# Altium schematic sheet 8_Secret.SchDoc
size A
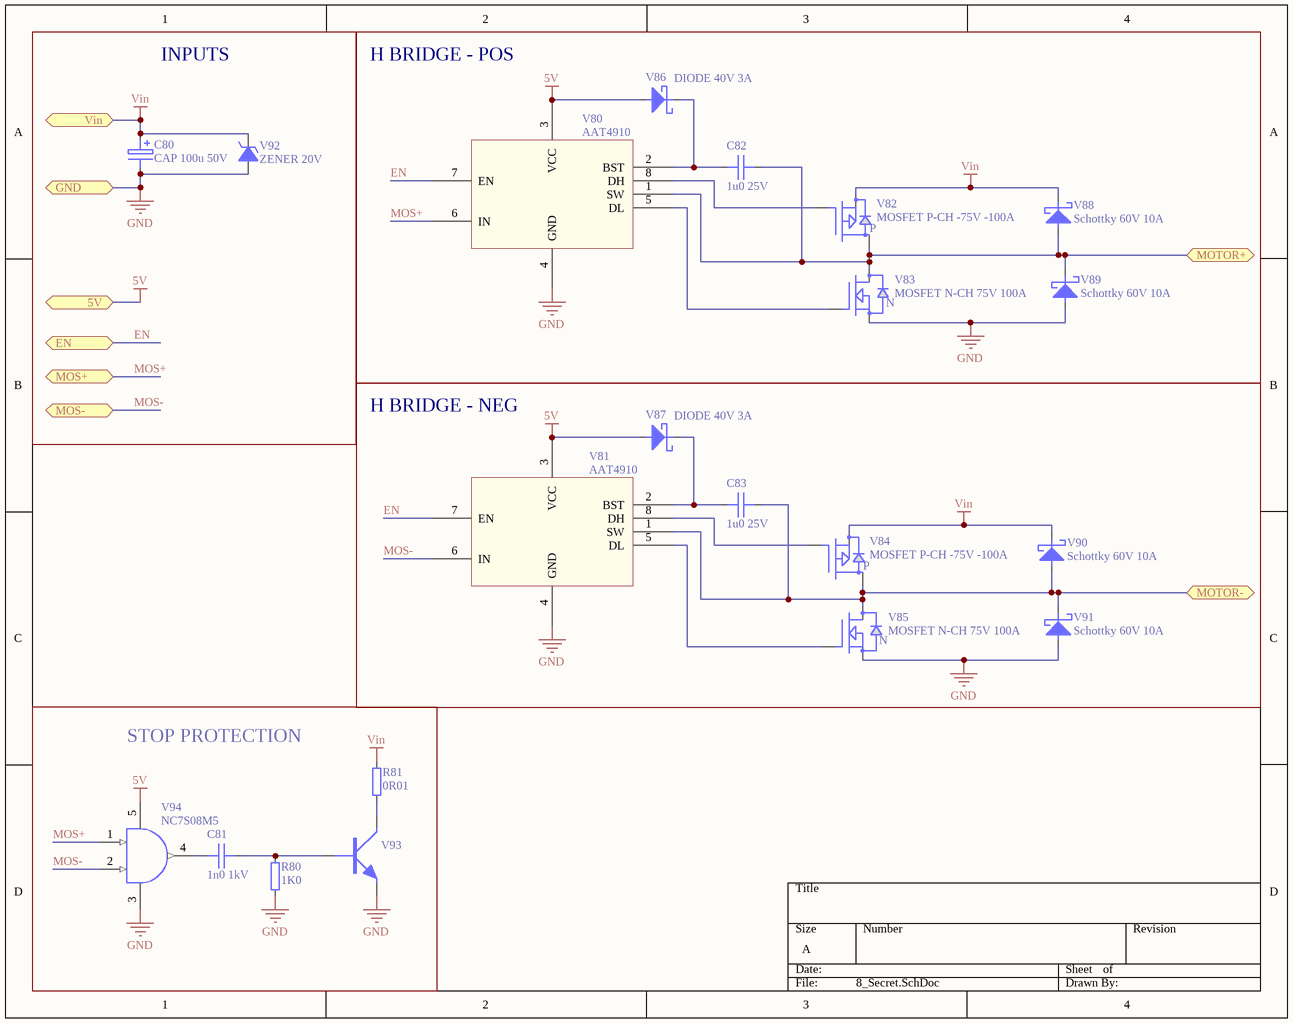
[diagram p0: 8_Secret.SchDoc]

## Parts
C80  CAP 100u 50V  [CAP-ELECT-SMD-F]
C81  1n0 1kV  [1206]
C82  1u0 25V  [1206]
C83  1u0 25V  [1206]
R80  1K0  [1206]
R81  0R01  [AXIAL-25.4-1.1-12.7]
V80  AAT4910  [TFSOJ-8]
V81  AAT4910  [TFSOJ-8]
V82  MOSFET P-CH -75V -100A  [TO263_2_D2PAK]
V83  MOSFET N-CH 75V 100A  [TO263_2_D2PAK]
V84  MOSFET P-CH -75V -100A  [TO263_2_D2PAK]
V85  MOSFET N-CH 75V 100A  [TO263_2_D2PAK]
V86  DIODE 40V 3A  [DO214AB-DIODE]
V87  DIODE 40V 3A  [DO214AB-DIODE]
V88  Schottky 60V 10A  [DO-214AB-DIODE]
V89  Schottky 60V 10A  [DO-214AB-DIODE]
V90  Schottky 60V 10A  [DO-214AB-DIODE]
V91  Schottky 60V 10A  [DO-214AB-DIODE]
V92  ZENER 20V  [DO-214AA-DIODE]
V93  BC846B  [SOT23]  (value not drawn)
V94  NC7S08M5  [SOT23-5]

## Blocks framed on the sheet
INPUTS: C80 V92
H BRIDGE - POS: C82 V80 V82 V83 V86 V88 V89
H BRIDGE - NEG: C83 V81 V84 V85 V87 V90 V91
STOP PROTECTION: C81 R80 R81 V93 V94

## Ports
5V, EN, GND, MOS+, MOS-, MOTOR+, MOTOR-, Vin

## Nets
5V: V80.3(VCC) V81.3(VCC) V86.a V87.a V94.5(VCC) ; port 5V
GND: C80.- R80.1 V80.4(GND) V81.4(GND) V83.y(s) V85.y(s) V89.a V91.a V92.a V93.y(Emitter) V94.3(GND) ; port GND
Vin: C80.+ R81.2 V82.y(s) V84.y(s) V88.k V90.k V92.k ; port Vin
EN: V80.7(EN) V81.7(EN) ; port EN
MOS+: V80.6(IN) V94.1 ; port MOS+
MOS-: V81.6(IN) V94.2 ; port MOS-
MOTOR+: C82.2 V80.1(SW) V82.x(d(tab)) V83.x(d) V88.a V89.k ; port MOTOR+
MOTOR-: C83.2 V81.1(SW) V84.x(d(tab)) V85.x(d) V90.a V91.k ; port MOTOR-
NetC81_1: C81.1 V94.4
NetC81_2: C81.2 R80.2 V93.z(Base)
NetC82_1: C82.1 V80.2(BST) V86.k
NetC83_1: C83.1 V81.2(BST) V87.k
NetR81_1: R81.1 V93.x(Collector)
NetV80_5: V80.5(DL) V83.z(gate)
NetV80_8: V80.8(DH) V82.z(gate)
NetV81_5: V81.5(DL) V85.z(gate)
NetV81_8: V81.8(DH) V84.z(gate)

## Notes on the sheet
- (in symbol 9926) P
- (in symbol 9927) N

## Library data of the parts
C80 = 5174: Capacitor Polarised; Part Field 1: CAP ELEC 100u +/-20% 50V VS SMD-F; Manufacturer: Panasonic-ECG; PartNumber: EEE1HA101UP; IPN: 5174; EndOfLife: Active EOL:Jul 2022; AltIPN1: 7605; AltDesc1: CAP ELEC 100u +/-20% 50V SMD-F; AltMFG1: Nichicon; AltPN1: UWT1H101MNL1GS; AltEOL1: Active EOL:Sep 2023; Characteristics: -40..+85C Reel=500; Lead_Process_Compatible: Yes; SubmittedBy: FXT; DeviceRank: 2; Part Field 2: Panasonic-ECG EEE1HA101UP; ComponentLink1Description: Panasonic-ECG_EEE1HA101UP_Panasonic_VS.pdf; ComponentLink2Description: Panasonic-ECG_EEE1HA101UP_Panasonic-SMD-Capacitor-ABA0000PE220.pdf; ComponentLink1URL: http://ecad.vsl.com.au/apps/BomGen/Data/rel/datasheets/Panasonic-ECG/Panasonic-ECG_EEE1HA101UP_Panasonic_VS.pdf; ComponentLink2URL: http://ecad.vsl.com.au/apps/BomGen/Data/rel/rohs_compliance/new_certificates/Panasonic-ECG_EEE1HA101UP_Panasonic-SMD-Capacitor-ABA0000PE220.pdf; Altium_Comment_Old: CAP ELEC 100u +/-20% 50V VS SMD-F; Altium_Comment: CAP 100u 50V; Symbol: CAP-POL; LastChanged: 23/05/14 15:25:48; AltROHS1: Nichicon_UWT1H101MNL1GS_RoHS.pdf; Supplier1: Tenrod; Supplier1_PartNumber: EEE1HA101UP; Supplier2: Digikey; Supplier2_PartNumber: PCE3917TR-ND; IPN_Search: 5174; OrderNumber: EEE1HA101UP; PartType: PCB; Price: US $0.16; CheckedBy: vhq; Price_100: M$0.203; Price_1000: M$0.173; Price_5000: M$0.152
C81 = 5155: Capacitor; Part Field 1: CAP CER 1n0 10% 1kV X7R 1206 RoHS; Manufacturer: Kemet; PartNumber: C1206C102KDRACTU; IPN: 5155; EndOfLife: Active EOL:Sep 2023; Characteristics: -55..+125C DF<=2.5% Reel=2500; Lead_Process_Compatible: No; SubmittedBy: SMC; DeviceRank: 2; Part Field 2: Kemet C1206C102KDRACTU; ComponentLink1Description: C1206C102KDRACTU.PDF; ComponentLink2Description: IPC_1.1_4_MLCC_X7R_C_071307.pdf; ComponentLink1URL: http://ecad.vsl.com.au/apps/BomGen/Data/rel/datasheets/new_parts/C1206C102KDRACTU.PDF; ComponentLink2URL: http://ecad.vsl.com.au/apps/BomGen/Data/rel/rohs_compliance/new_certificates/IPC_1.1_4_MLCC_X7R_C_071307.pdf; Altium_Comment_Old: CAP CER 1n0 10% 1kV X7R 1206 RoHS; Altium_Comment: 1n0 1kV; Symbol: CAP; LastChanged: 30/05/11 16:43:26; Supplier1: Arrow; Supplier1_PartNumber: C1206C102KDRACTU; Supplier2: Digikey; Supplier2_PartNumber: 399-3437-1-ND; IPN_Search: 5155; OrderNumber: C1206C102KDRACTU; PartType: PCB; Price: 0.352; CheckedBy: FXT; Price_100: M$0.084; Price_1000: M$0.051; Price_5000: M$0.040
C82 C83 = 2833: Capacitor; Part Field 1: CAP CER 1u0 10% 25V X7R 1206 RoHS; Manufacturer: Murata; PartNumber: GRM31MR71E105KA01L; IPN: 2833; EndOfLife: Active EOL:Jul 2022; Characteristics: -55..125C; Lead_Process_Compatible: Yes; SubmittedBy: LGG; DeviceRank: 2; Part Field 2: Murata GRM31MR71E105KA01L; ComponentLink1Description: Murata_GRMseries_DS.pdf; ComponentLink2Description: Murata_Generic_RCS.pdf; ComponentLink1URL: http://ecad.vsl.com.au/apps/BomGen/Data/rel/datasheets/new_parts/Murata_GRMseries_DS.pdf; ComponentLink2URL: http://ecad.vsl.com.au/apps/BomGen/Data/rel/rohs_compliance/new_certificates/Murata_Generic_RCS.pdf; Altium_Comment_Old: CAP CER 1u0 10% 25V X7R 1206 RoHS; Altium_Comment: 1u0 25V; Symbol: CAP; LastChanged: 14/04/08 18:06:49; Supplier2: Farnell; Supplier2_PartNumber: 9527761; IPN_Search: 2833; OrderNumber: GRM31MR71E105KA01L; PartType: PCB; Price: 0.13; CheckedBy: ART; Price_100: M$0.072; Price_1000: M$0.064; Price_5000: M$0.047
R80 = 3843: Resistor; Part Field 1: RES 1K0 1% 250mW 1206 RoHS; Manufacturer: Phycomp; PartNumber: RC1206FR-071KL; IPN: 3843; EndOfLife: Active EOL:Jan 2031; Characteristics: 100ppm/C -55..+155C U=150Vrms Reel=5000pcs; OrderNumber: 232272461002L; Lead_Process_Compatible: Yes; SubmittedBy: ART; DeviceRank: 2; Part Field 2: Phycomp RC1206FR-071KL; ComponentLink1Description: Phycomp_RC1206series_DS.pdf; ComponentLink2Description: Phycomp_Generic_RCS.pdf; ComponentLink1URL: http://ecad.vsl.com.au/apps/BomGen/Data/rel/datasheets/new_parts/Phycomp_RC1206series_DS.pdf; ComponentLink2URL: http://ecad.vsl.com.au/apps/BomGen/Data/rel/rohs_compliance/new_certificates/Phycomp_Generic_RCS.pdf; Altium_Comment_Old: RES 1K0 1% 250mW 1206 RoHS; Altium_Comment: 1K0; Symbol: RES; Supplier1: Arrow; Supplier1_PartNumber: RC1206FR-071KL; Supplier2: Xon; IPN_Search: 3843; PartType: PCB; CheckedBy: ART; Price_5000: M$0.004
R81 = 9888: Resistor; Part Field 1: RES 0R01 4W 5% 200mV Wirewound Axial RoHS; Manufacturer: TE Connectivity; PartNumber: SBL4R01J; IPN: 9888; Characteristics: 100ppm/C -55..+250C; Lead_Process_Compatible: Yes; SubmittedBy: zmze; DeviceRank: 2; Part Field 2: TE Connectivity SBL4R01J; ComponentLink1Description: TE Connectivity_SBL4R01J_Sense Resistor - TE Connectivity SBL4R01J.pdf; ComponentLink2Description: Compliant; ComponentLink1URL: http://ecad.vsl.com.au/apps/BomGen/Data/rel/datasheets/TE Connectivity/TE Connectivity_SBL4R01J_Sense Resistor - TE Connectivity SBL4R01J.pdf; Altium_Comment_Old: RES 0R01 4W 5% 200mV Wirewound Axial RoHS; Altium_Comment: 0R01; Symbol: RES; LastChanged: 04/08/16 17:20:22; Supplier1: Element14; Supplier1_PartNumber: 1173906; IPN_Search: 9888; OrderNumber: SBL4R01J; PartType: PCB
V80 V81 = 9920: Part Field 1: IC Half-Bridge Motor Driver; Manufacturer: Skyworks Solutions; PartNumber: AAT4910IJS-T1; IPN: 9920; Lead_Process_Compatible: Yes; SubmittedBy: zmze; DeviceRank: 2; Part Field 2: Skyworks Solutions AAT4910IJS-T1; ComponentLink2Description: Compliant; Altium_Comment_Old: IC Half-Bridge Motor Driver; Altium_Comment: IC Half-Bridge Motor Driver; Symbol: AAT4910; LastChanged: 22/08/16 17:21:43; Supplier1: DigiKey; Supplier1_PartNumber: 863-1558-1-ND; IPN_Search: 9920; OrderNumber: AAT4910IJS-T1; PartType: PCB
V82 V84 = 9926: MOSFET P CHANNEL GENERIC TO263; Manufacturer: On Semiconductor; PartNumber: SMP3003-TL-1E; IPN: 9926; Characteristics: Id(pulse)=-400A Vds=-75V Rds = 0R0062; Lead_Process_Compatible: Yes; SubmittedBy: zmze; DeviceRank: 2; Part Field 1: MOSFET P-CH -75V -100A; Part Field 2: On Semiconductor SMP3003-TL-1E; ComponentLink1Description: On Semiconductor_SMP3003-TL-1E_ENA1655-D.PDF; ComponentLink2Description: Compliant; ComponentLink1URL: http://ecad.vsl.com.au/apps/BomGen/Data/rel/datasheets/On Semiconductor/On Semiconductor_SMP3003-TL-1E_ENA1655-D.PDF; Altium_Comment_Old: MOSFET P-CH -75V -100A; Altium_Comment: MOSFET P-CH -75V -100A; Symbol: MOSFET-P-TO263; LastChanged: 26/08/16 15:19:52; Supplier1: Digikey; Supplier1_PartNumber: SMP3003-TL-1EOSCT-ND; IPN_Search: 9926; OrderNumber: SMP3003-TL-1E; PartType: PCB
V83 V85 = 9927: MOSFET N CHANNEL GENERIC TO263; Manufacturer: Infineon; PartNumber: IRF1407STRLPBF; IPN: 9927; Characteristics: Id(pulse)=-520A Vds=75V Rds = 0R0078; Lead_Process_Compatible: Yes; SubmittedBy: zmze; DeviceRank: 2; Part Field 1: MOSFET N-CH 75V 100A; Part Field 2: Infineon IRF1407STRLPBF; ComponentLink1Description: Infineon_IRF1407STRLPBF_Infineon-irf1407spbf-DS-v01_02-EN.pdf; ComponentLink2Description: Compliant; ComponentLink1URL: http://ecad.vsl.com.au/apps/BomGen/Data/rel/datasheets/Infineon/Infineon_IRF1407STRLPBF_Infineon-irf1407spbf-DS-v01_02-EN.pdf; Altium_Comment_Old: MOSFET N-CH 75V 100A; Altium_Comment: MOSFET N-CH 75V 100A; Symbol: MOSFET-N-TO263; LastChanged: 26/08/16 15:24:49; Supplier1: Digikey; Supplier1_PartNumber: IRF1407STRLPBFCT-ND; IPN_Search: 9927; OrderNumber: IRF1407STRLPBF; PartType: PCB
V86 V87 = 3420: DIODE SCHOTTKY GENERIC; Part Field 1: DIODE SCHOTTKY 40V 3A SMC RoHS; Manufacturer: ON Semiconductor; PartNumber: MBRS340T3G; IPN: 3420; EndOfLife: Active EOL:Apr 2021; Characteristics: Vrmax=40V Ifmax=3A -65..+125C reel=2500; Lead_Process_Compatible: Yes; SubmittedBy: AJR; DeviceRank: 1; Part Field 2: ON Semiconductor MBRS340T3G; ComponentLink1Description: OnSemi_MBRS3x0T3.pdf; ComponentLink2Description: OnSemi_MBRS3x0T3G_MD.xls; ComponentLink1URL: http://ecad.vsl.com.au/apps/BomGen/Data/rel/datasheets/new_parts/OnSemi_MBRS3x0T3.pdf; ComponentLink2URL: http://ecad.vsl.com.au/apps/BomGen/Data/rel/rohs_compliance/new_certificates/OnSemi_MBRS3x0T3G_MD.xls; Altium_Comment_Old: DIODE SCHOTTKY 40V 3A SMC RoHS; Altium_Comment: DIODE 40V 3A; Symbol: SCHOTTKY; LastChanged: 8/07/08 10:55:18; Supplier1: Arrow Electronics Australia; Supplier1_PartNumber: MBRS340T3G; Supplier2: Farnell; Supplier2_PartNumber: 9557377; IPN_Search: 3420; OrderNumber: MBRS340T3G; PartType: PCB; Price: 0.531; CheckedBy: ART; Price_100: M$0.215; Price_1000: M$0.166; Price_5000: M$0.142
V88-V91 = 9925: DIODE SCHOTTKY GENERIC; Part Field 1: DIODE SCHOTTKY 60V 10A SMD RoHS; Manufacturer: Micro Commercial Co; PartNumber: SK106-TP; IPN: 9925; Characteristics: Vrmax=60V Ifmax=10A Vf=0.85V -55..+125; Lead_Process_Compatible: Yes; SubmittedBy: zmze; DeviceRank: 2; Part Field 2: Micro Commercial Co SK106-TP; ComponentLink1Description: Micro Commercial Co_SK106-TP_SK102-SK1010(HSMC).PDF; ComponentLink2Description: Compliant; ComponentLink1URL: http://ecad.vsl.com.au/apps/BomGen/Data/rel/datasheets/Micro Commercial Co/Micro Commercial Co_SK106-TP_SK102-SK1010(HSMC).PDF; Altium_Comment_Old: DIODE SCHOTTKY 60V 10A SMD RoHS; Altium_Comment: Schottky 60V 10A; Symbol: SCHOTTKY; LastChanged: 26/08/16 14:34:18; Supplier1: Digikey; Supplier1_PartNumber: SK106-TPCT-ND; IPN_Search: 9925; OrderNumber: SK106-TP; PartType: PCB
V92 = 9928: DIODE ZENER SMT; Part Field 1: DIODE ZENER 20V 5% 5W SOT23 RoHS; Manufacturer: Micro Commercial Co; PartNumber: SMBJ5357B-TP; IPN: 9928; Characteristics: Vf=900mV Izt=5mA Zzt=90R Ir=5uA -65..+150C Reel=3000; Lead_Process_Compatible: Yes; SubmittedBy: zmze; DeviceRank: 2; Part Field 2: Micro Commercial Co SMBJ5357B-TP; ComponentLink1Description: Micro Commercial Co_SMBJ5357B-TP_SMBJ5338B-SMBJ5388B(SMB).pdf; ComponentLink2Description: Micro Commercial Co_SMBJ5357B-TP_NXP_BZX84-C3V6_RCC.pdf; ComponentLink1URL: http://ecad.vsl.com.au/apps/BomGen/Data/rel/datasheets/Micro Commercial Co/Micro Commercial Co_SMBJ5357B-TP_SMBJ5338B-SMBJ5388B(SMB).pdf; ComponentLink2URL: http://ecad.vsl.com.au/apps/BomGen/Data/rel/rohs_compliance/new_certificates/Micro Commercial Co_SMBJ5357B-TP_NXP_BZX84-C3V6_RCC.pdf; Altium_Comment_Old: DIODE ZENER 20V 5% 5W SOT23 RoHS; Altium_Comment: ZENER 20V; Symbol: ZENER; LastChanged: 26/08/16 16:03:02; Supplier1: DigiKey; Supplier1_PartNumber: SMBJ5357B-TPMSCT-ND; IPN_Search: 9928; OrderNumber: SMBJ5357B-TP; PartType: PCB
V93 = 3412: NPN Transistor SOT23; Part Field 1: BJT NPN BC846 SOT23 RoHS; Manufacturer: NXP; IPN: 3412; EndOfLife: Active EOL:Nov 2023; Characteristics: Ic=100mA Vceo=65V Pt=250mW Tj=150degC Hfe=200..450; OrderNumber: 9335 895 60215; Lead_Process_Compatible: Yes; SubmittedBy: ART; DeviceRank: 1; Part Field 2: NXP BC846B; ComponentLink1Description: NXP_BC84xseries_DS.pdf; ComponentLink2Description: NXP_BC846B_MD.xls; ComponentLink1URL: http://ecad.vsl.com.au/apps/BomGen/Data/rel/datasheets/new_parts/NXP_BC84xseries_DS.pdf; ComponentLink2URL: Not Found; Altium_Comment_Old: BJT NPN BC846 SOT23 RoHS; Altium_Comment: BC846B; Symbol: NPN-SOT23; PartNumber: BC846B; LastChanged: 24/08/09 11:56:43; Supplier1: Mouser; Supplier1_PartNumber: 771-BC846B-T/R; Supplier2: Digikey; Supplier2_PartNumber: 568-1632-1-ND; IPN_Search: 3412; PartType: PCB; CheckedBy: LZZ; Price_100: M$0.040; Price_1000: M$0.027; Price_5000: M$0.020
V94 = 4648: IC TINY LOGIC AND GATE; Part Field 1: IC AND 74x08 Single 2-input SOT23-5 RoHS; Manufacturer: Fairchild; IPN: 4648; EndOfLife: Active EOL:Dec 2021; Characteristics: Vcc=2..6V Cimax=10p HC compatible Reel=3K; OrderNumber: NC7S08M5X; Lead_Process_Compatible: Yes; SubmittedBy: KZB; DeviceRank: 2; Part Field 2: Fairchild NC7S08M5; ComponentLink1Description: Fairchild_NC7S08_DS.pdf; ComponentLink2Description: Fairchild_SOT23-SC70_Generic_RCS.pdf; ComponentLink1URL: http://ecad.vsl.com.au/apps/BomGen/Data/rel/datasheets/new_parts/Fairchild_NC7S08_DS.pdf; ComponentLink2URL: http://ecad.vsl.com.au/apps/BomGen/Data/rel/rohs_compliance/new_certificates/Fairchild_SOT23-SC70_Generic_RCS.pdf; Altium_Comment_Old: IC AND 74x08 Single 2-input SOT23-5 RoHS; Altium_Comment: NC7S08M5; Symbol: 74X08-SINGLE-GATE; PartNumber: NC7S08M5; LastChanged: 12/08/08 14:41:28; Supplier1: Arrow Electronics Australia P/L; Supplier1_PartNumber: NC7S08M5X; Supplier2: Digikey; Supplier2_PartNumber: NC7S08M5XCT-ND; IPN_Search: 4648; PartType: PCB; Price: 0.21USD; CheckedBy: ART; Price_100: M$0.314; Price_1000: M$0.219; Price_5000: M$0.204